# EAGLE design foot_contact_switch_v1 (EAGLE 6.5.0)
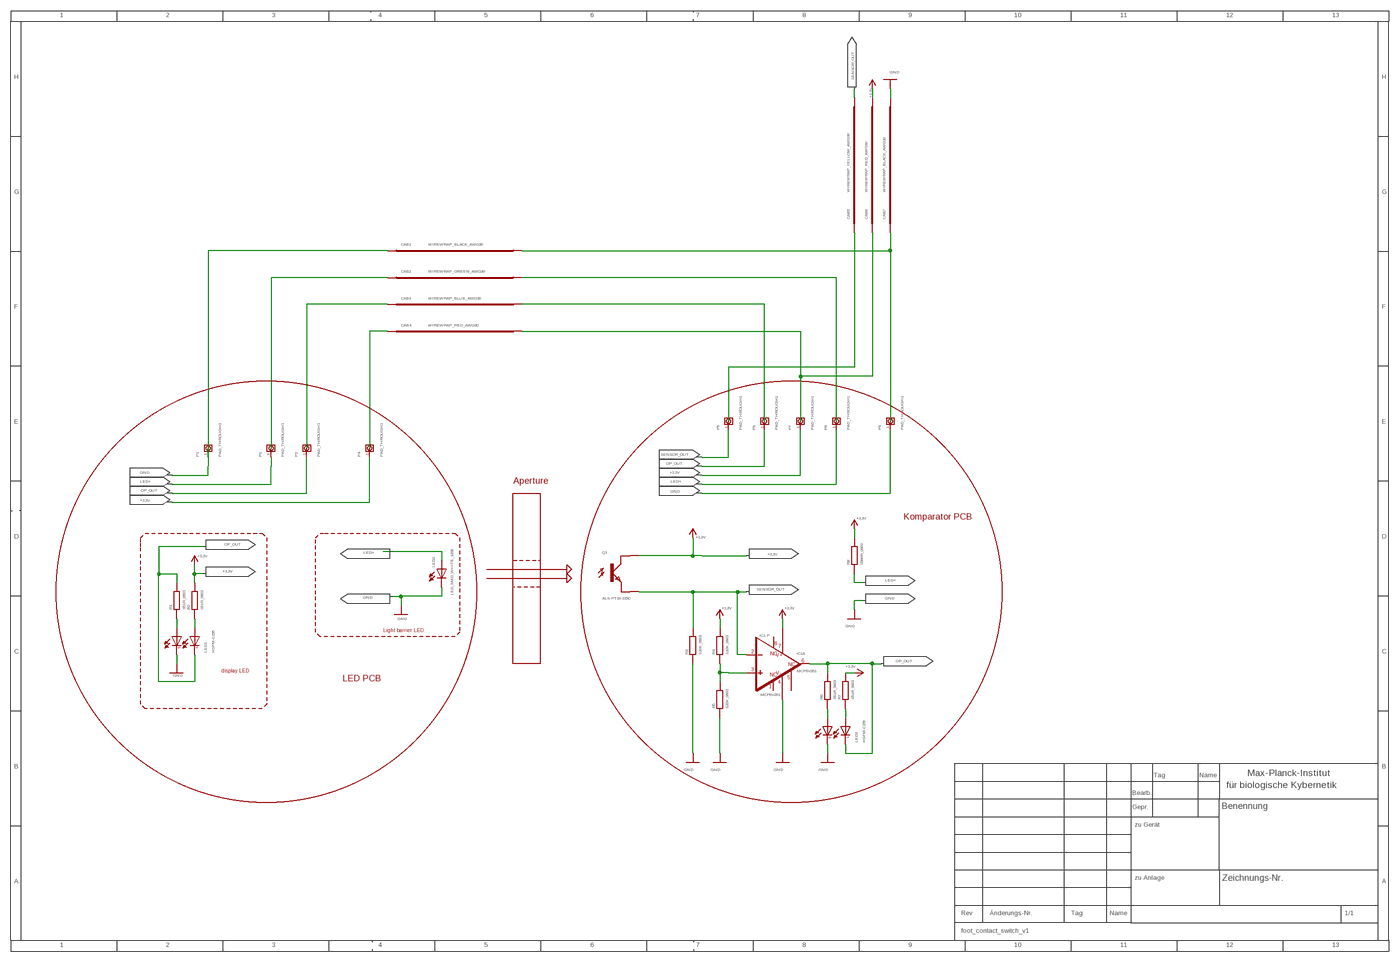
[diagram p0: schematic, sheet 1, overview]
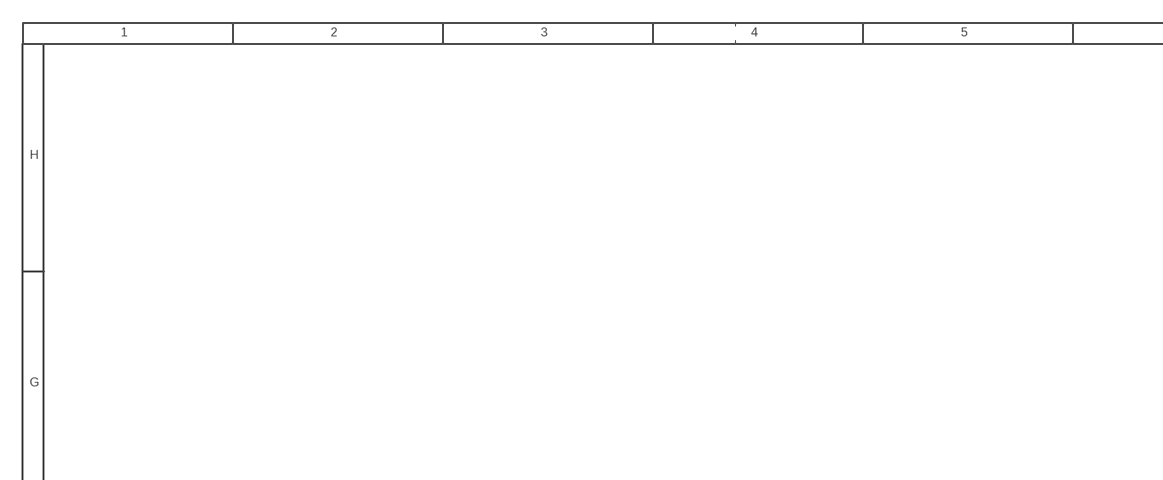
[diagram p1: schematic, sheet 1, part 1 of 4]
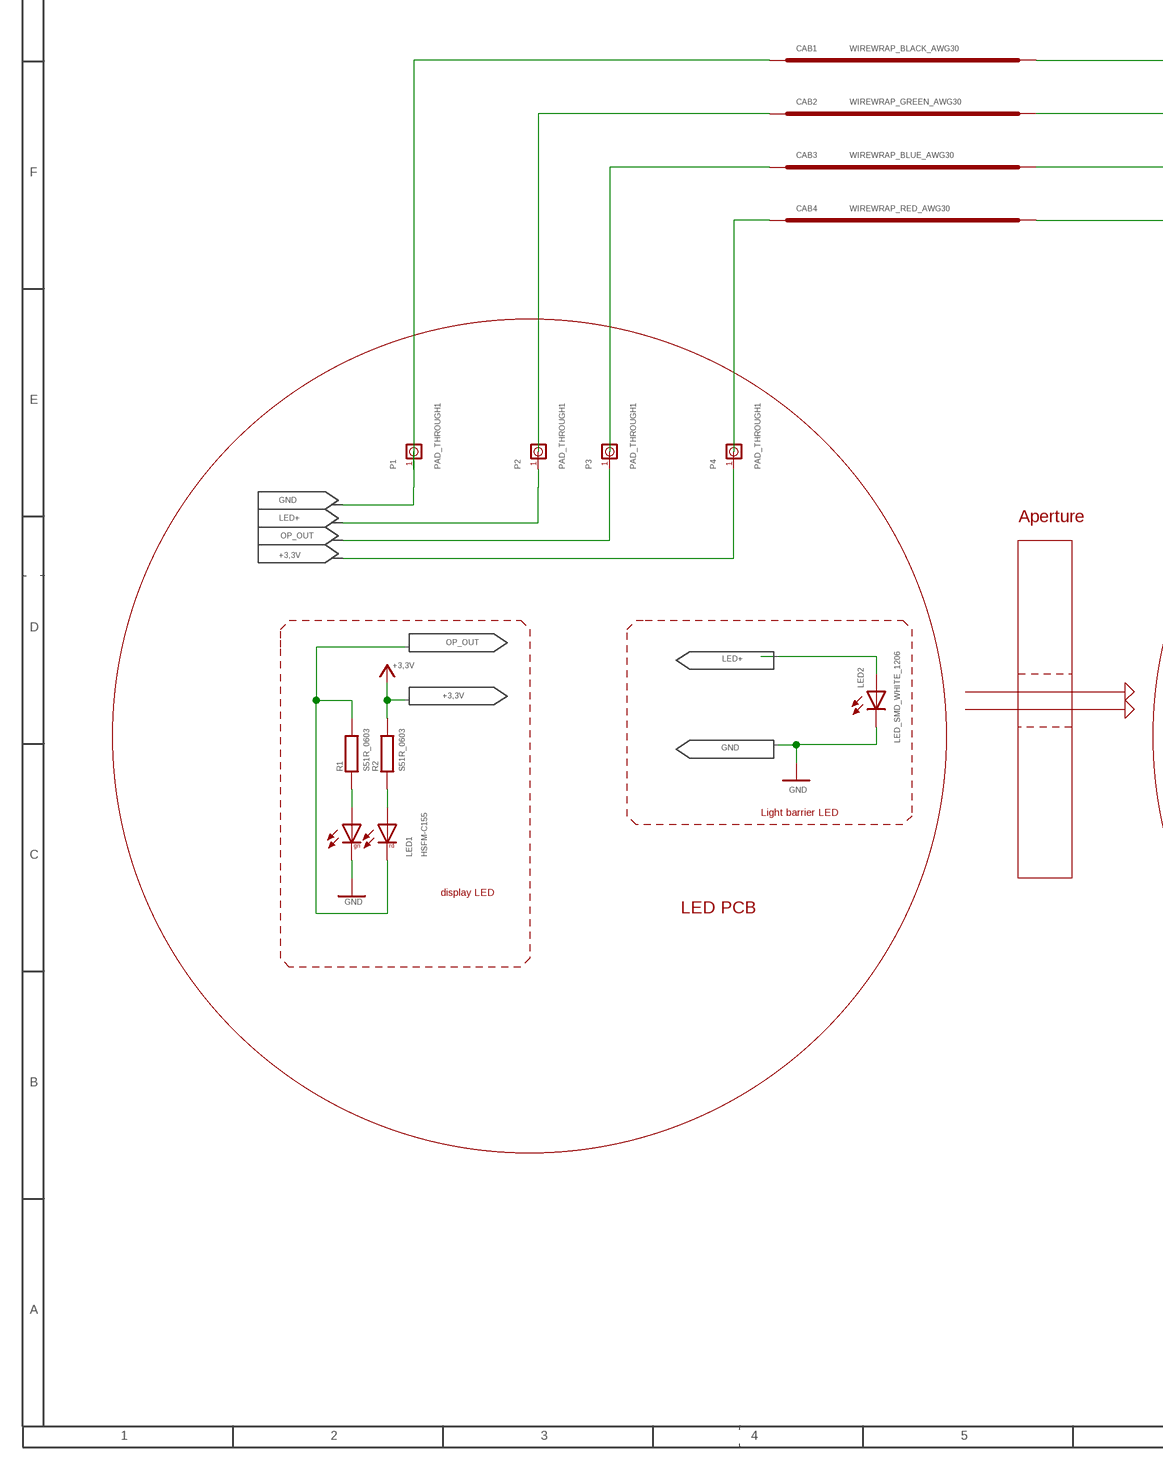
[diagram p2: schematic, sheet 1, part 2 of 4]
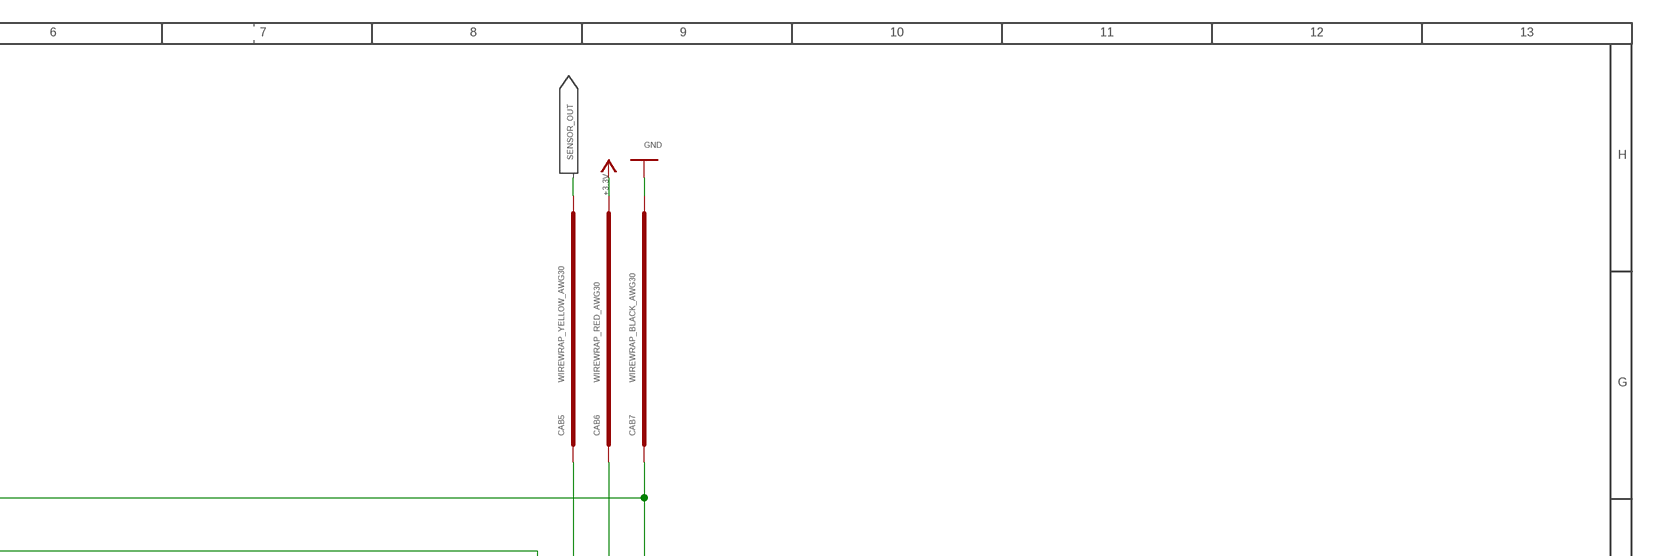
[diagram p3: schematic, sheet 1, part 3 of 4]
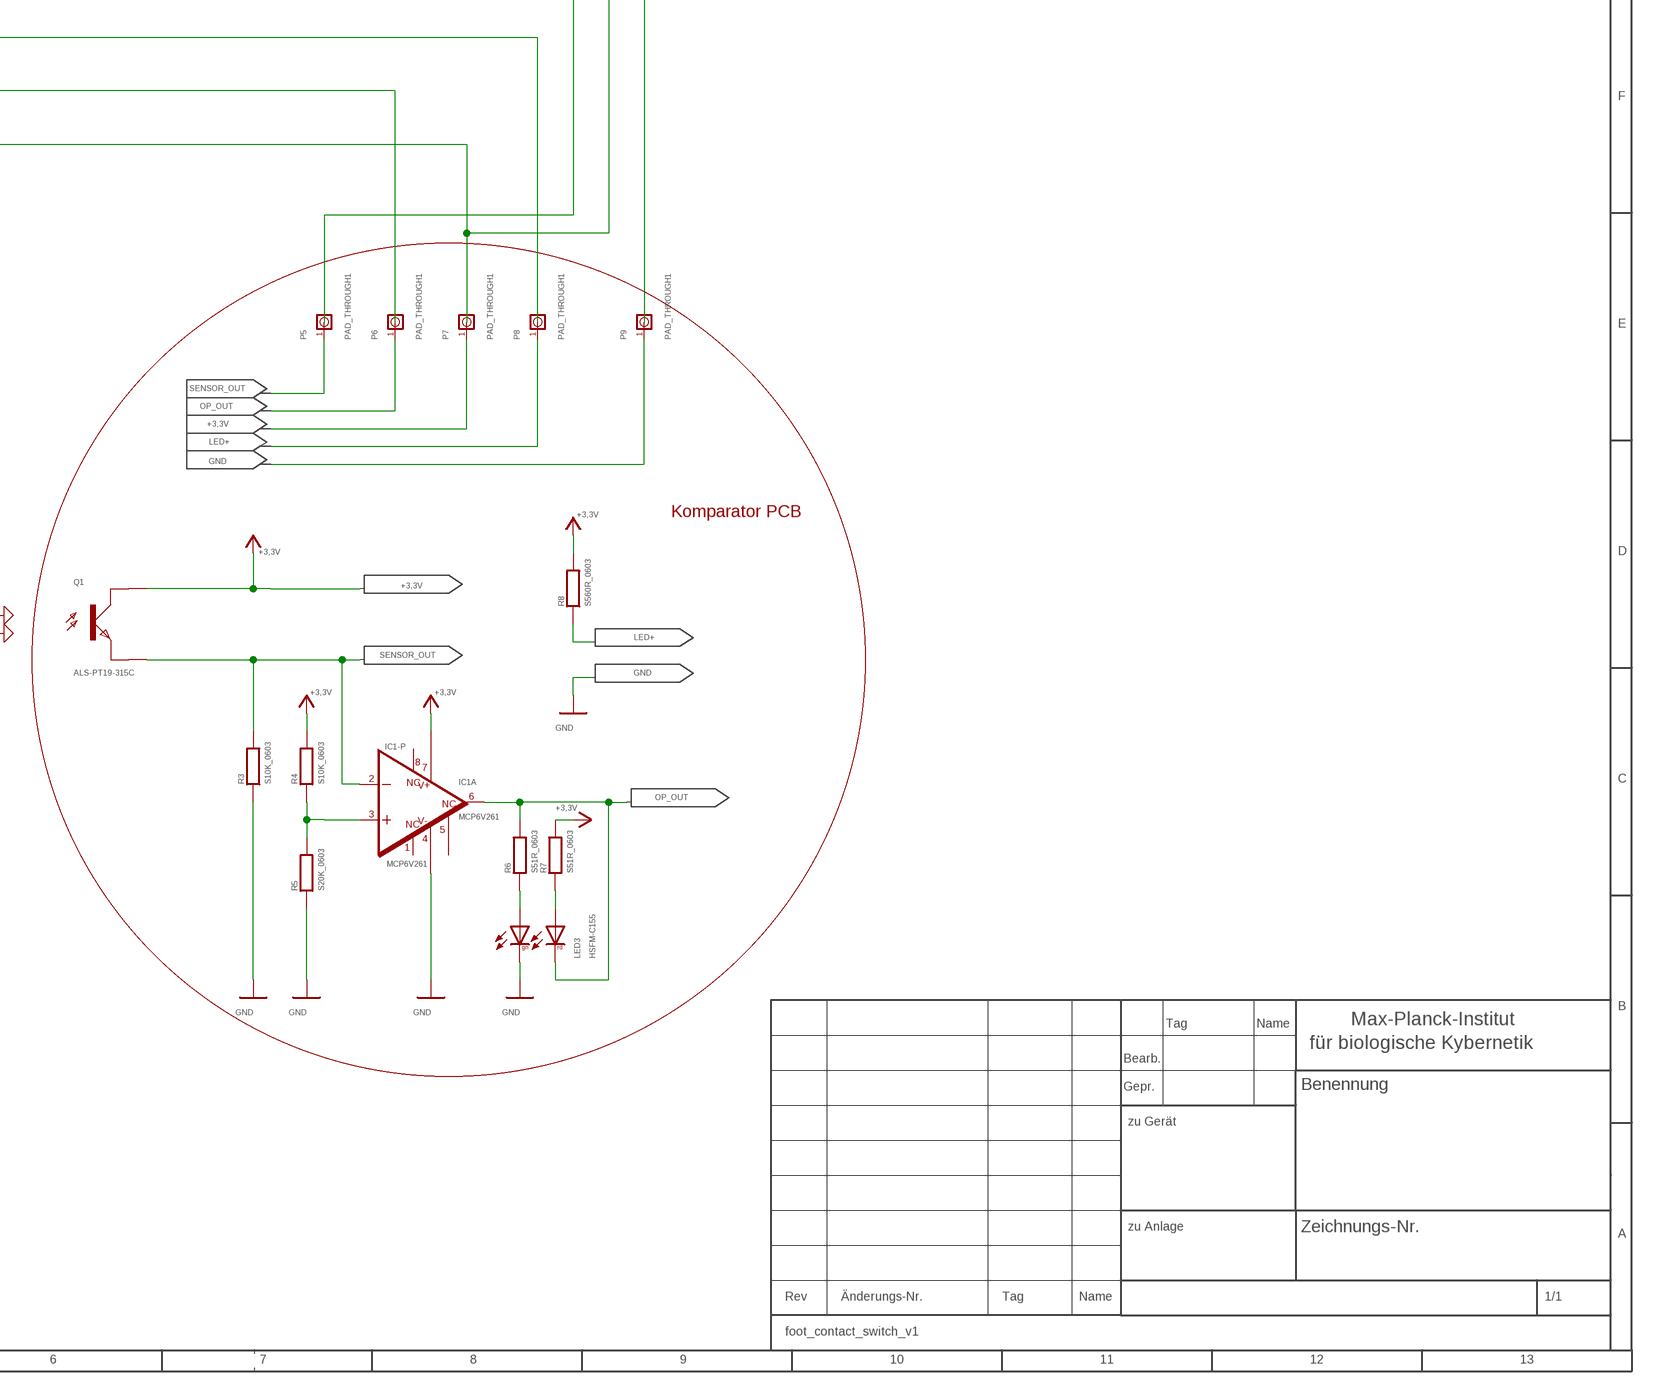
[diagram p4: schematic, sheet 1, part 4 of 4]

## Parts
CAB1  WIREWRAP_BLACK_AWG30  [WIREWRAP_AWG30]
CAB2  WIREWRAP_GREEN_AWG30  [WIREWRAP_AWG30]
CAB3  WIREWRAP_BLUE_AWG30  [WIREWRAP_AWG30]
CAB4  WIREWRAP_RED_AWG30  [WIREWRAP_AWG30]
CAB5  WIREWRAP_YELLOW_AWG30  [WIREWRAP_AWG30]
CAB6  WIREWRAP_RED_AWG30  [WIREWRAP_AWG30]
CAB7  WIREWRAP_BLACK_AWG30  [WIREWRAP_AWG30]
IC1  MCP6V261  [MSOP8]
LED1  HSFM-C155  [3225]
LED2  LED_SMD_WHITE_1206  [1206C]
LED3  HSFM-C155  [3225]
P1  PAD_THROUGH1  [PAD_TH_056X055]
P2  PAD_THROUGH1  [PAD_TH_056X055]
P3  PAD_THROUGH1  [PAD_TH_056X055]
P4  PAD_THROUGH1  [PAD_TH_056X055]
P5  PAD_THROUGH1  [PAD_TH_056X055]
P6  PAD_THROUGH1  [PAD_TH_056X055]
P7  PAD_THROUGH1  [PAD_TH_056X055]
P8  PAD_THROUGH1  [PAD_TH_056X055]
P9  PAD_THROUGH1  [PAD_TH_056X055]
Q1  ALS-PT19-315C  [FOTOTRANSISTOR]
R1  S51R_0603  [0603R]
R2  S51R_0603  [0603R]
R3  S10K_0603  [0603R]
R4  S10K_0603  [0603R]
R5  S20K_0603  [0603R]
R6  S51R_0603  [0603R]
R7  S51R_0603  [0603R]
R8  S560R_0603  [0603R]

## Nets
+3,3V: CAB6.7 IC1.7 P4.P$1 P7.P$1 Q1.1(C) R2.P$2 R4.P$2 R7.P$2 R8.P$2
GND: CAB7.7 IC1.4 LED1.2 LED2.-(C1) LED3.2 P1.P$1 P9.P$1 R3.P$1 R5.P$1
LED+: LED2.+(A1) P2.P$1 P8.P$1 R8.P$1
N$1: IC1.3 R4.P$1 R5.P$2
N$2: CAB4.7 CAB6.1
N$3: LED3.1 R6.P$1
N$4: CAB1.7 CAB7.1
N$5: LED3.3 R7.P$1
N$6: CAB5.1
N$7: LED1.1 R1.P$1
N$8: LED1.3 R2.P$1
N$9: CAB4.1
N$10: CAB3.7
N$12: CAB3.1
N$13: CAB2.1
N$14: CAB1.1
N$15: CAB2.7
OP_OUT: IC1.6 LED1.4 LED3.4 P3.P$1 P6.P$1 R1.P$2 R6.P$2
SENSOR_OUT: CAB5.7 IC1.2 P5.P$1 Q1.2(E) R3.P$2
Unconnected: IC1.1 IC1.5 IC1.8

## Notes on the sheet
- Aperture
- Komparator PCB
- Light barrier LED
- display LED
- LED PCB

## Library data of the parts
CAB1 CAB7 = joshi:WIREWRAP_BLACK_AWG30: Wirewrap cable black 30AWG part number: 370103009 Farnell order code: 91F5041 package: wirewrap_black_30AWG manufacturer: KABELTRONIK
CAB2 = joshi:WIREWRAP_GREEN_AWG30: Wirewrap cable green 30AWG part number: 370103003 Farnell order code: 91F502 package: wirewrap_green_30AWG manufacturer: KABELTRONIK
CAB3 = joshi:WIREWRAP_BLUE_AWG30: Wirewrap cable blue 30AWG part number: 370103007 Farnell order code: 91F5045 package: wirewrap_blue_30AWG manufacturer: KABELTRONIK
CAB4 CAB6 = joshi:WIREWRAP_RED_AWG30: Wirewrap cable red 30AWG part number: 370103008 Farnell order code: 91F5043 package: wirewrap_red_30AWG manufacturer: KABELTRONIK
CAB5 = joshi:WIREWRAP_YELLOW_AWG30: Wirewrap cable yellow 30AWG part number: 370103004 Farnell order code: 91F500 package: wirewrap_yellow_30AWG manufacturer: KABELTRONIK
IC1 = joshi:MCP6V26: SMD OP Amp rail-to-rail part number: MCP6V26-E/MS RS order code: 755-9568 package: MSOP-8 manufacturer: MICROCHIP
LED1 LED3 = joshi:HSFM-C155: SMD dual LED red/green 20mA 2,1V part number: HSMF-C155 Farnell order code: 5790888 package: 3225 manufacturer: AVAGO
LED2 = OPTO_Display:LED_SMD_WHITE_1206: SMD LED White 20mA 3V part number: 158301260 Farnell order code: 2470224 package: 1206 manufacturer: WURTH ELEKTRONIK
P1-P9 = Connectors:PAD_THROUGH: 000000; 000,00; Solder Pad PAD_01 Diameter=56mil, Drill=0.55mm
Q1 = joshi:ALS-PT19-315C: SMD phototransistor part number: ALS-PT19-315C/L177/TR8 Digi-key order code: 1080-1244-1-ND package: 2-SMD manufacturer: EVERLIGHT
R1 R2 R6 R7 = joshi:S51R_0603: SMD resistor 51Ohm part number: MCT06030C5109FP500 Farnell order code: 2614454 package: 0603 manufacturer: VISHAY
R3 R4 = joshi:S10K_0603: SMD resistor 10kOhm part number: RN73C1J10KBTDF Farnell order code: 2613718 package: 0603 manufacturer: TE CONNECTIVITY
R5 = joshi:S20K_0603: SMD resistor 20kOhm part number: CRCW060320K0FKEA Farnell order code: 1469774 package: 0603 manufacturer: VISHAY
R8 = joshi:S560R_0603: SMD resistor 560Ohm part number: WR06X5600FTL Farnell order code: 2502470 package: 0603 manufacturer: WALSIN

## Board
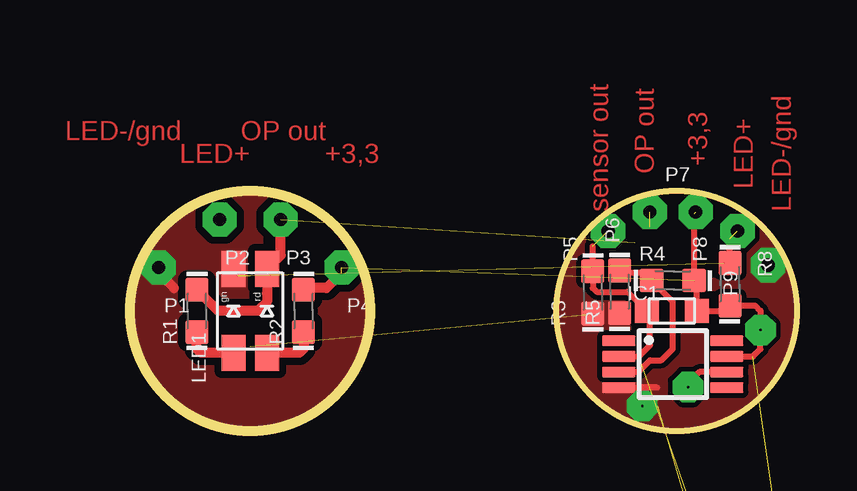
[diagram p5: board, top side]
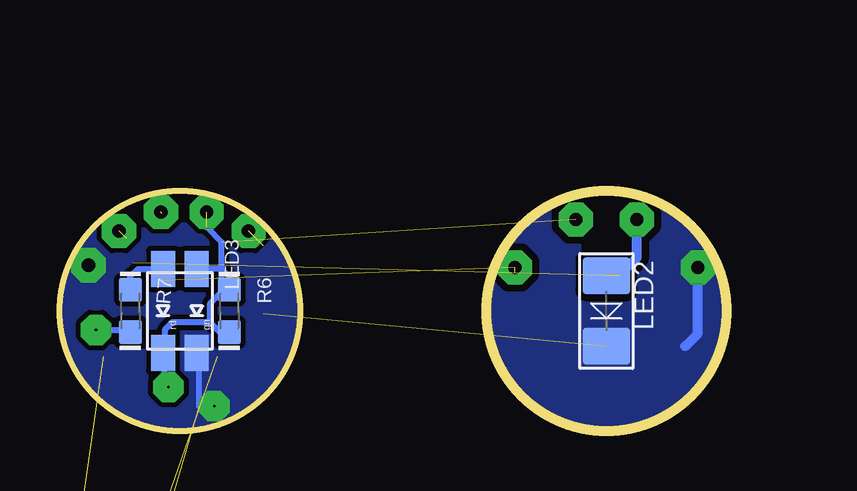
[diagram p6: board, bottom side, seen from below]

Size 27.78 x 10 mm. Coordinates in mm from the lower left corner, seen from the top.
Outline: circle at 22.78,5 radius 5
Outline: circle at 5,5 radius 5
Copper layers (1*16): Top 0.035mm / dielectric 1.5mm / Bottom 0.035mm
Design rules "default *": minimum track width 10mil, minimum drill 24mil, track to track 8mil, track to pad 8mil, pad to pad 8mil, via to via 8mil, smd to smd 8mil, copper to edge 0mil, drill to drill 8mil, minimum pad ring 10mil, minimum via ring 8mil, stop-mask expansion 4mil, vias tented up to drill 10mil, thermal gap 10mil

### Footprints (pad centres in the part's own frame; a part is rotated, then mirrored left to right if it is on the bottom)
WIREWRAP_AWG30 = drill 0.406 pad 0.813 square: 1 -15.24,0 | drill 0.406 pad 0.813: 7 15.24,0
MSOP8 = smd 0.45 x 1.4: 1 -0.975,-2.25; 2 -0.325,-2.25; 3 0.325,-2.25; 4 0.975,-2.25; 5 0.975,2.25; 6 0.325,2.25; 7 -0.325,2.25; 8 -0.975,2.25
3225 = smd 1.5 x 1: 1 -1.75,0.7; 2 1.75,0.7; 3 -1.75,-0.7; 4 1.75,-0.7
1206C = smd 1.524 x 1.981: + -1.473,0; - 1.473,0
PAD_TH_056X055 = drill 0.55 pad 1.422 octagon: P$1 0,0
FOTOTRANSISTOR = smd 1 x 1: 1 -1.05,0; 2 1.05,0
0603R = smd 1.016 x 0.965: P$1 -0.889,0; P$2 0.889,0

### Placement (x,y rotation side)
CAB1  16.43,-6.43 0 top  (outside the outline)
CAB2  16.43,-16.59 0 top  (outside the outline)
CAB3  16.43,-11.51 0 top  (outside the outline)
CAB4  16.43,-21.67 0 top  (outside the outline)
CAB5  16.43,-26.75 0 top  (outside the outline)
CAB6  16.43,-36.91 0 top  (outside the outline)
CAB7  16.43,-31.83 0 top  (outside the outline)
IC1  22.62,2.78 270 top
LED1  5,5 90 top
LED2  5,5 270 bottom
LED3  22.78,5 270 bottom
P1  1.19,6.81 180 top
P2  3.73,8.81 180 top
P3  6.27,8.81 180 top
P4  8.81,6.81 180 top
P5  19.92,8.33 90 top
P6  21.67,9.13 90 top
P7  23.57,9.13 0 top
P8  25.32,8.33 90 top
P9  26.59,6.91 90 top
Q1  22.58,5 180 top
R1  2.78,5 90 top
R2  7.22,5 90 top
R3  19.29,5.77 90 top
R4  22.62,6.27 0 top
R5  20.4,5.79 90 top
R6  20.72,5 270 bottom
R7  24.84,5 270 bottom
R8  25,6.11 270 top

### Tracks (layer width: path | path; a pad name or v marks a point on that pad's centre or on a via)
+3,3V  (via drill 0.1 pad 1.27)  (4 unrouted)
  Top 0.254: IC1.7 25.96,3.1 26.27,3.41 v26.27,4.21 26.27,5 26.05,5.22 R8.P$2 24.78,5 Q1.1 23.63,6.15 R4.P$2 23.51,6.33 23.51,9.06
  Top 0.406: 8.81,6.59 8.18,5.95 6.97,5.95 R2.P$2
  Bottom 0.254: v26.27,4.21 24.94,4.21 R7.P$2
GND  (via drill 0.1 pad 1.27)  (2 unrouted)
  Top 0.254: IC1.4 21.96,1.8 21.35,1.8 21.35,1.83 v21.35,1.03
  Top 0.406: P1.P$1 1.19,6.59 1.83,5.95
  Bottom 0.254: v21.35,1.03 21.99,1.03 21.99,1.51 21.99,3.16 LED3.2
  Bottom 0.406: 1.71,3.53 1.19,4.05 P1.P$1
  pour Top (no thermals): 17.78,5 arc-180 27.78,5 arc-180
  pour Bottom (no thermals): 17.78,5 arc-180 27.78,5 arc-180
  pour Bottom (isolate 0.305, no thermals): 10,5 arc-180 0,5 arc-180
  pour Top (isolate 0.305, no thermals): 10,5 arc-180 0,5 arc-180
LED+  (3 unrouted)
  Top 0.254: 24.75,7 R8.P$1 25,8.02
  Bottom 0.406: 4.48,6.47 3.73,7.22 P2.P$1
N$1
  Top 0.254: IC1.3 21.18,2.45 21.67,2.94 22.14,2.94 22.62,3.41 22.62,5.38 R4.P$1 21.73,6.37 21.51,6.59 20.49,6.59 R5.P$2
N$2  (1 unrouted)
N$3
  Bottom 0.254: R6.P$1 20.72,6.43 21.03,6.75 LED3.1
N$4  (1 unrouted)
N$5
  Bottom 0.254: R7.P$1 24.84,6.43 24.53,6.75 LED3.3
N$7
  Top 0.406: LED1.1 2.94,3.25 2.78,3.41 R1.P$1
N$8
  Top 0.406: R2.P$1 7.22,3.41 7.06,3.25 6.04,3.25 LED1.3
OP_OUT  (via drill 0.1 pad 1.27)  (2 unrouted)
  Top 0.254: IC1.6 23.73,2.45 23.57,2.3 v23.26,1.83
  Top 0.406: R1.P$2 3.67,5 5.32,5 5.7,5.38 5.7,5.73 LED1.4 6.27,7.32 P3.P$1
  Bottom 0.254: R6.P$2 21.1,4.11 21.51,4.52 | 21.51,4.52 23.1,4.52 23.41,4.21 23.41,3.31 LED3.4 23.57,3.16 v23.26,1.83 | 21.51,4.52 21.51,5.32 21.03,5.79 21.03,7.86 21.67,8.49
SENSOR_OUT  (2 unrouted)
  Top 0.254: 19.29,7.7 R3.P$2 19.29,5.95 19.45,5.79 20.74,5.79 Q1.2 21.67,4.86 21.67,3.57 21.2,3.1 IC1.2

### Text on the board
Top: LED-/gnd | OP out | LED+ | +3,3 | OP out | +3,3 | LED+ | sensor out | LED-/gnd